# EAGLE design M_M_ext_meteo_RJ11 (EAGLE 9.6.2)
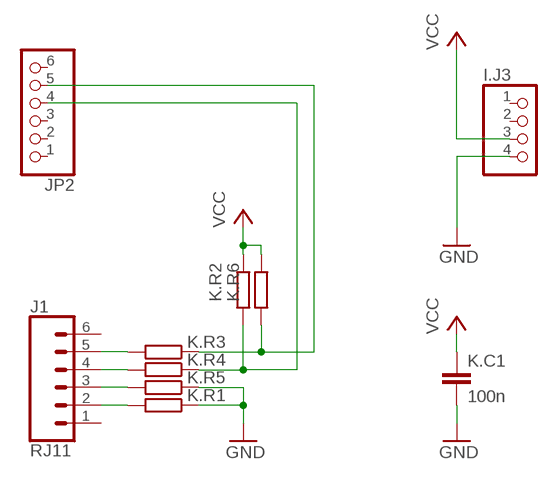
[diagram p0: schematic, sheet 1]

## Parts
I.J3  PINHD-1X4  [1X04]
J1  RJ11  RJ11-6  [RJ11-6]
JP2  PINHD-1X6  [1X06]
K.C1  100n  C-EUC0603  [C0603]
K.R1  100  R-EU_R0603  [R0603]
K.R2  10k  R-EU_R0603  [R0603]
K.R3  100  R-EU_R0603  [R0603]
K.R4  100  R-EU_R0603  [R0603]
K.R5  100  R-EU_R0603  [R0603]
K.R6  10k  R-EU_R0603  [R0603]

## Nets
GND: I.J3.4 K.C1.2 K.R1.1 K.R5.1
N$1: J1.5 K.R3.2
N$2: JP2.5 K.R3.1 K.R6.2
N$3: JP2.4 K.R2.2 K.R4.1
N$4: J1.4 K.R4.2
N$7: J1.3 K.R5.2
N$8: J1.2 K.R1.2
VCC: I.J3.3 K.C1.1 K.R2.1 K.R6.1
Unconnected: I.J3.1 I.J3.2 J1.1 J1.6 JP2.1 JP2.2 JP2.3 JP2.6

## Library data of the parts
I.J3 = pinhead2:PINHD-1X4: PIN HEADER
J1 = SparkFun-Connectors:RJ11-6: RJ11 Jack - 6 pin Commonly found on CAT3 devices and some Microchip programmers. Here is the connector we sell at SparkFun: RJ11 6-Pin Connector <https://www.sparkfun.com/products/132> (PRT-00132) Datasheet <http://www.sparkfun.com/datasheets/Prototyping/Connectors/RJ11-Datasheet.pdf> It is used on this SparkFun product: SparkFun Weather Shield <https://www.sparkfun.com/products/12081> (DEV-12081) Weather Meters <https://www.sparkfun.com/products/8942> (SEN-08942); PROD_ID: CONN-08590; SF_ID: PRT-00132
JP2 = pinhead2:PINHD-1X6: PIN HEADER
K.C1 = rcl:C-EU: CAPACITOR, European symbol; SPICEPREFIX: C
K.R1-K.R6 = rcl:R-EU_: RESISTOR, European symbol; SPICEPREFIX: R

## Board
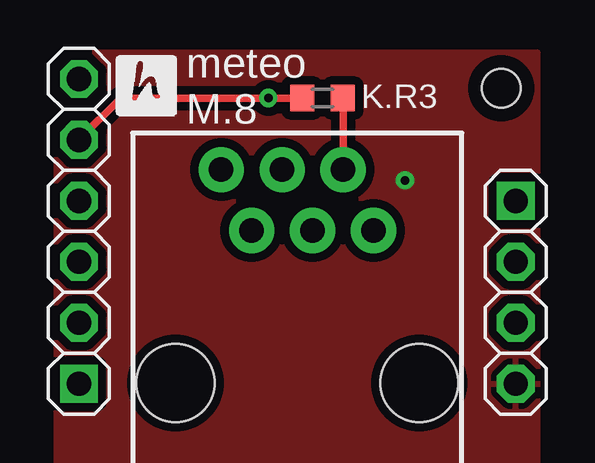
[diagram p1: board, top side]
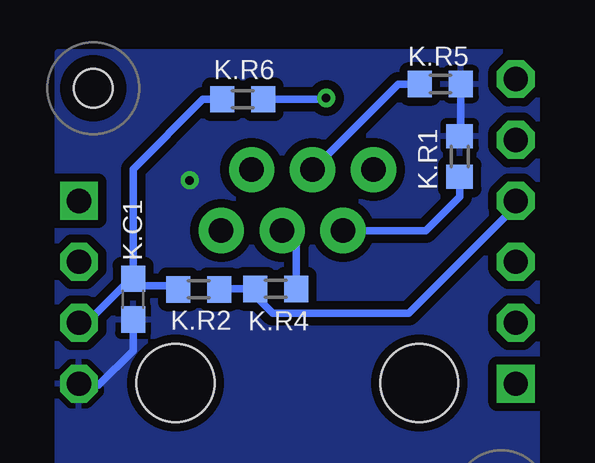
[diagram p2: board, bottom side, seen from below]

No outline drawn. Coordinates in mm, seen from the top.
Copper layers (1*16): Top 0.035mm / dielectric 1.5mm / Bottom 0.035mm
Design rules "default *": minimum track width 12mil, minimum drill 0.35mm, track to track 14mil, track to pad 12mil, pad to pad 12mil, via to via 12mil, smd to smd 10mil, copper to edge 15mil, drill to drill 15mil, minimum pad ring 10mil, minimum via ring 8mil, stop-mask expansion 4mil, vias tented up to drill 0mil, thermal gap 10mil
Holes 1.6 mm at 19,19 2,2
tRestrict: area 18,18 to 20,20; area 1,1 to 3,3
bRestrict: area 1,1 to 3,3; area 18,18 to 20,20

### Footprints (pad centres in the part's own frame; a part is rotated, then mirrored left to right if it is on the bottom)
1X04 = drill 1.016 pad 1.575 square: 1 -3.81,0 | drill 1.016 pad 1.575 octagon: 2 -1.27,0; 3 1.27,0; 4 3.81,0
RJ11-6 = drill 1.016 pad 1.88: 1 -3.175,8.89; 2 -1.905,6.35; 3 -0.635,8.89; 4 0.635,6.35; 5 1.905,8.89; 6 3.175,6.35 | hole 3.251: -5.08,0; 5.08,0
1X06 = drill 1.016 pad 1.575 square: 1 -6.35,0 | drill 1.016 pad 1.575 octagon: 2 -3.81,0; 3 -1.27,0; 4 1.27,0; 5 3.81,0; 6 6.35,0
C0603 = smd 1.1 x 1: 1 -0.85,0; 2 0.85,0
R0603 = smd 1 x 1.1: 1 -0.85,0; 2 0.85,0

### Placement (x,y rotation side)
I.J3  19.6,10.5 270 top
J1  10.5,6.72 0 top
JP2  1.4,13.04 90 top
K.C1  17.35,10.21 270 bottom
K.R1  3.73,16.15 270 bottom
K.R2  14.61,10.62 0 bottom
K.R3  11.55,18.59 0 top
K.R4  11.4,10.64 0 bottom
K.R5  4.54,19.18 180 bottom
K.R6  12.78,18.54 0 bottom

### Tracks (layer width: path | path; a pad name or v marks a point on that pad's centre or on a via)
GND  (via drill 0.35)
  Bottom 0.305: K.C1.2 17.34,8.06 18.79,6.62 19.53,6.62 I.J3.4 | K.R5.1 3.69,17.03 K.R1.1
  other vias: 14.99,15.16
  pour Top (isolate 0.254): 0.47,20.5 20.5,20.5 20.5,0.5 0.47,0.5
  pour Bottom (isolate 0.254): 0.5,20.5 20.5,20.5 20.5,0.5 0.5,0.5
N$1
  Top 0.305: K.R3.2 J1.5
N$2  (via drill 0.35)
  Top 0.305: JP2.5 3.14,18.59 v9.3,18.59 K.R3.1
  Bottom 0.305: K.R6.2 9.35,18.54 v9.3,18.59
N$3
  Bottom 0.305: JP2.4 1.4,14.09 5.85,9.63 11.52,9.63 12.25,10.36 K.R4.1 13.73,10.64 K.R2.2
N$4
  Bottom 0.305: J1.4 10.55,12.48 K.R4.2
N$7
  Bottom 0.305: K.R5.2 6.3,19.18 J1.3
N$8
  Bottom 0.305: J1.2 5.15,13.07 3.73,14.48 K.R1.2
VCC
  Bottom 0.305: K.C1.1 17.44,11.06 19.27,9.23 I.J3.3 | K.C1.1 17.07,10.78 15.62,10.78 K.R2.1 | K.C1.1 17.34,15.64 14.44,18.54 K.R6.1

### Text on the board
tPlace: meteo / M.8